# EAGLE design controller-v1 (EAGLE 7.5.0)
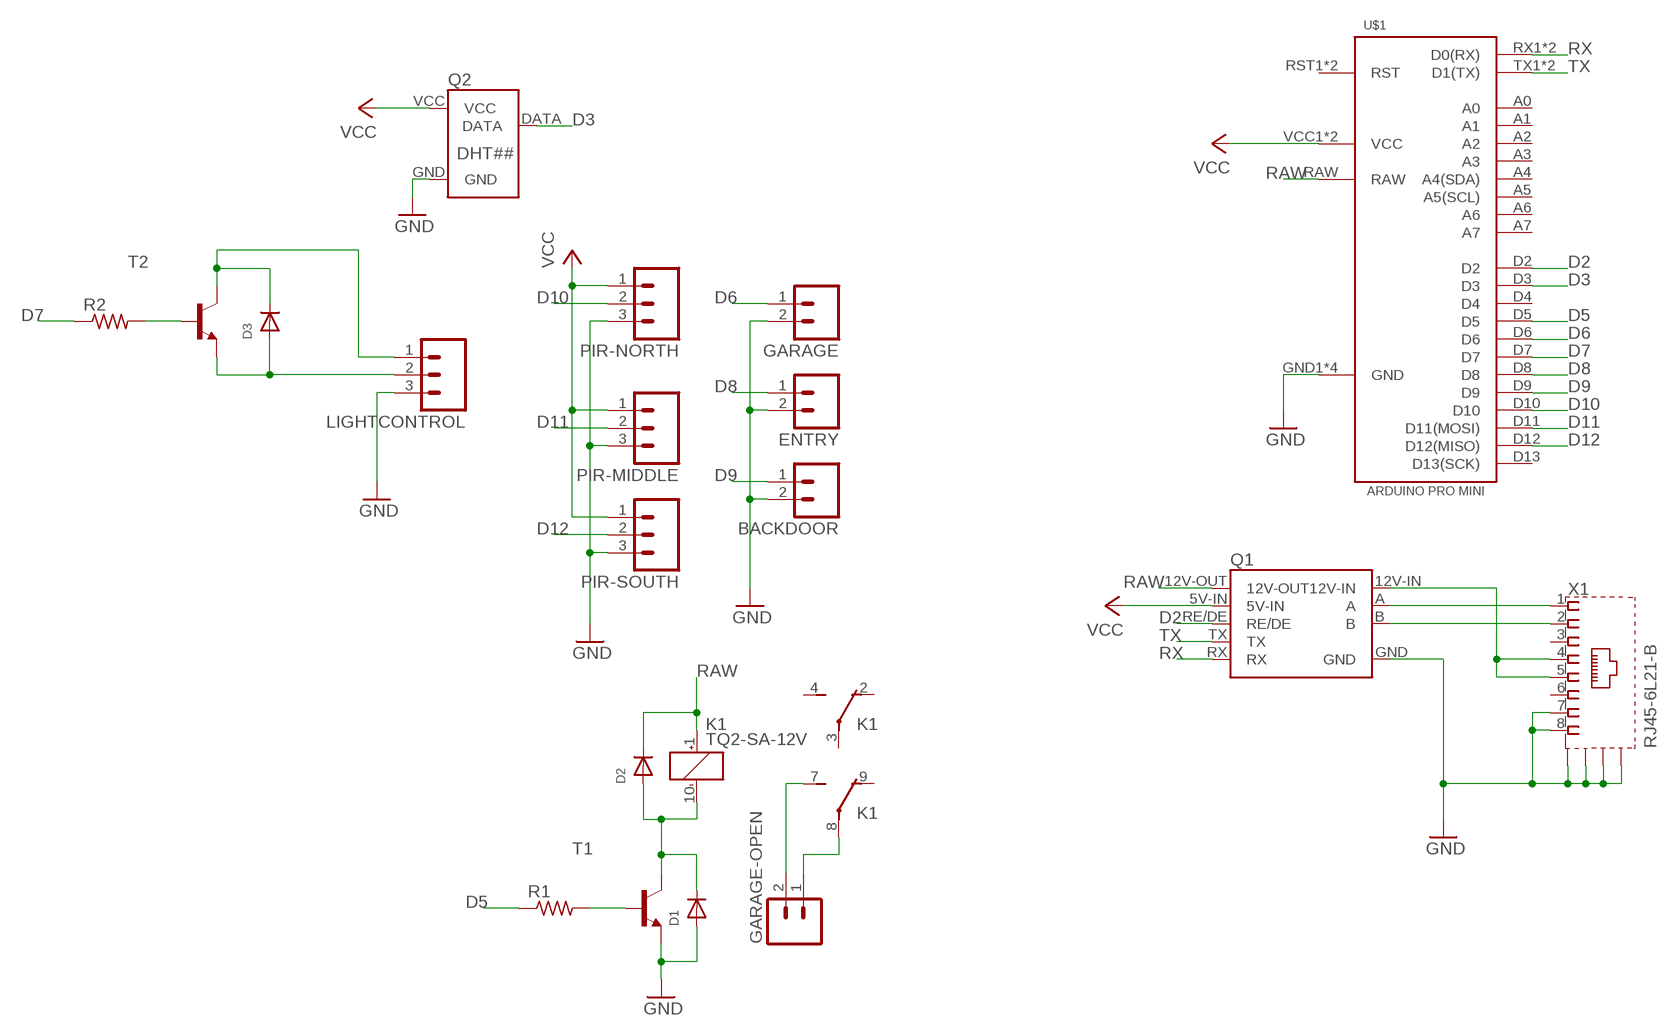
[diagram p0: schematic, sheet 1]

## Parts
BACKDOOR  M02  [02P]
D1  DIODESMA  [SMADIODE]
D2  DIODESMA  [SMADIODE]
D3  DIODESMA  [SMADIODE]
ENTRY  M02  [02P]
GARAGE  M02  [02P]
GARAGE-OPEN  M02  [02P]
K1  TQ2-SA-12V  [TQ-SA]
LIGHTCONTROL  M03  [03P]
PIR-MIDDLE  M03  [03P]
PIR-NORTH  M03  [03P]
PIR-SOUTH  M03  [03P]
Q1  RS485-ADAPTER0.05-CONNECTOR  [RS485-ADAPTOR-05]
Q2  DHT##  [CONNECTOR-4-PIN-0.1]
R1  R-US_R0603  [R0603]
R2  R-US_R0603  [R0603]
T1  BC808-NPN-SOT23-BEC  [SOT23-BEC]
T2  BC808-NPN-SOT23-BEC  [SOT23-BEC]
U$1  ARDUINO-PRO-MINI  [ARDUINO-PRO-MINI]
X1  RJ45-6L21-B  [RJ45-SHIELD1]

## Nets
D2: Q1.RE/DE U$1.D2
D3: Q2.DATA U$1.D3
D5: R1.1 U$1.D5
D6: GARAGE.1 U$1.D6
D7: R2.1 U$1.D7
D8: ENTRY.1 U$1.D8
D9: BACKDOOR.1 U$1.D9
D10: PIR-NORTH.2 U$1.D10
D11: PIR-MIDDLE.2 U$1.D11(D11(MOSI))
D12: PIR-SOUTH.2 U$1.D12(D12(MISO))
GND: BACKDOOR.2 D1.A ENTRY.2 GARAGE.2 LIGHTCONTROL.3 PIR-MIDDLE.3 PIR-NORTH.3 PIR-SOUTH.3 Q1.GND Q2.GND T1.E U$1.GND1(GND) U$1.GND2(GND) U$1.GND3(GND) U$1.GND4(GND) X1.7 X1.8 X1.S1(S) X1.S2(S) X1.S3(S) X1.S4(S)
N$1: D3.A LIGHTCONTROL.2 T2.E
N$8: Q1.12V-IN X1.4 X1.5
N$9: GARAGE-OPEN.1 K1.8(2:P)
N$10: Q1.A X1.1
N$11: Q1.B X1.2
N$12: GARAGE-OPEN.2 K1.7(2:S)
N$13: D1.C D2.A K1.10(_:-) T1.C
N$14: R1.2 T1.B
N$21: D3.C LIGHTCONTROL.1 T2.C
N$22: R2.2 T2.B
RAW: D2.C K1.1(_:+) Q1.12V-OUT U$1.RAW
RX: Q1.RX U$1.RX1(D0(RX)) U$1.RX2(D0(RX))
TX: Q1.TX U$1.TX1(D1(TX)) U$1.TX2(D1(TX))
VCC: PIR-MIDDLE.1 PIR-NORTH.1 PIR-SOUTH.1 Q1.5V-IN Q2.VCC U$1.VCC1(VCC) U$1.VCC2(VCC)
Unconnected: K1.2(1:O) K1.3(1:P) K1.4(1:S) K1.9(2:O) U$1.A0 U$1.A1 U$1.A2 U$1.A3 U$1.A4(A4(SDA)) U$1.A5(A5(SCL)) U$1.A6 U$1.A7 U$1.D4 U$1.D13(D13(SCK)) U$1.RST1(RST) U$1.RST2(RST) X1.3 X1.6

## Library data of the parts
BACKDOOR ENTRY GARAGE GARAGE-OPEN = con-amp-quick:M02: AMP QUICK CONNECTOR; OC_FARNELL: unknown; OC_NEWARK: unknown
D1-D3 = adafruit:DIODE: Diode SMADIODE - SMA Surface Mount Package 20V 1A Schottky Diode Digikey: 641-1014-6-ND DO-1N4148 - Through Hole Small Current Diode SOD-123 20V 1 A (.5mV Vf) Schottky Diode - Digikey: MBRX120TPMSCT-ND SOD-323 10V 570mA (.38mV Vf, 3ns) Schottky Diode - Digikey: ZLLS410CT-ND SOD-523 30V 30mA Schottky Diode (RB751S-40TE61) - Digikey: RB751S-40TE61CT-ND SOT23-R/W - SOT23 Package (R = Solder Paste/Reflow Ovens, W = Hand-Soldering) BAT54Film 40V 300mA - Digikey: 497-7162-1-ND
K1 = relay:TQ2?*: LOW PROFILE 2 FORM C RELAY NAiS Source: http://www.mew-europe.com/.. en_ds_61020_0001.pdf Source: http://www.mew-europe.com/.. en_ds_61020_0004.pdf; MF: AROMAT/ MATSUSHITA; MPN: TQ2SA-12V; OC_FARNELL: 1124056; OC_NEWARK: 64K3203
LIGHTCONTROL PIR-MIDDLE PIR-NORTH PIR-SOUTH = con-amp-quick:M03: AMP QUICK CONNECTOR; OC_FARNELL: unknown; OC_NEWARK: unknown
Q1 = serge:RS485-ADAPTER
Q2 = serge:DHT##
R1 R2 = adafruit:R-US_: RESISTOR, American symbol
T1 T2 = transistor:*-NPN-: NPN Transistror BF959 corrected 2008.03.06
U$1 = serge:ARDUINO-PRO-MINI
X1 = con-tycoelectronics:RJ45*2: RJ45 Low Profile Shield Type 2 For all RJ45 L, LC, LCT and X Series Models Source: www.tycoelectronics.com .. ENG_DS_1654001_1099_RJ_L_0507.pdf; OC_FARNELL: unknown; OC_NEWARK: unknown

## Board
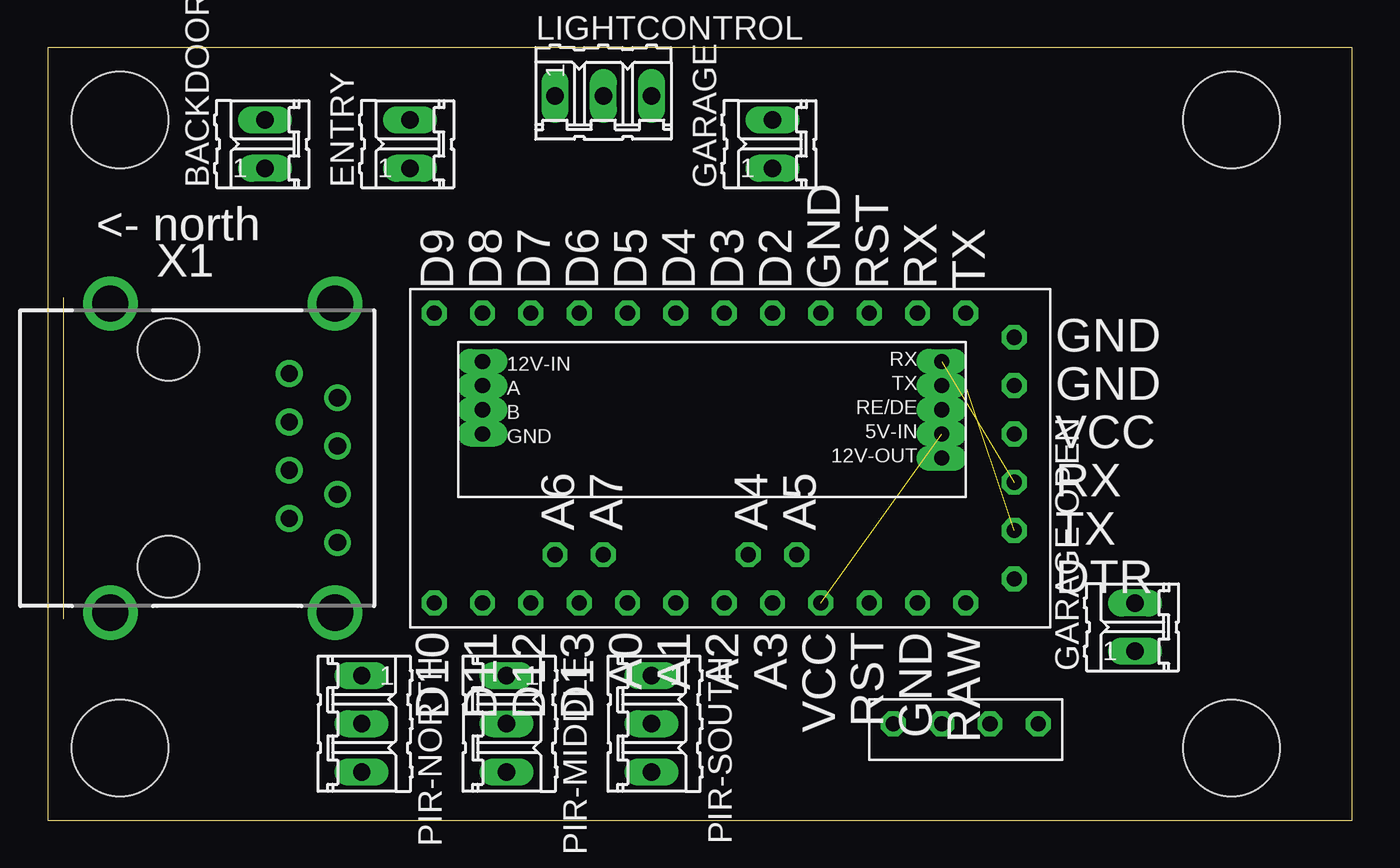
[diagram p1: board, top side]
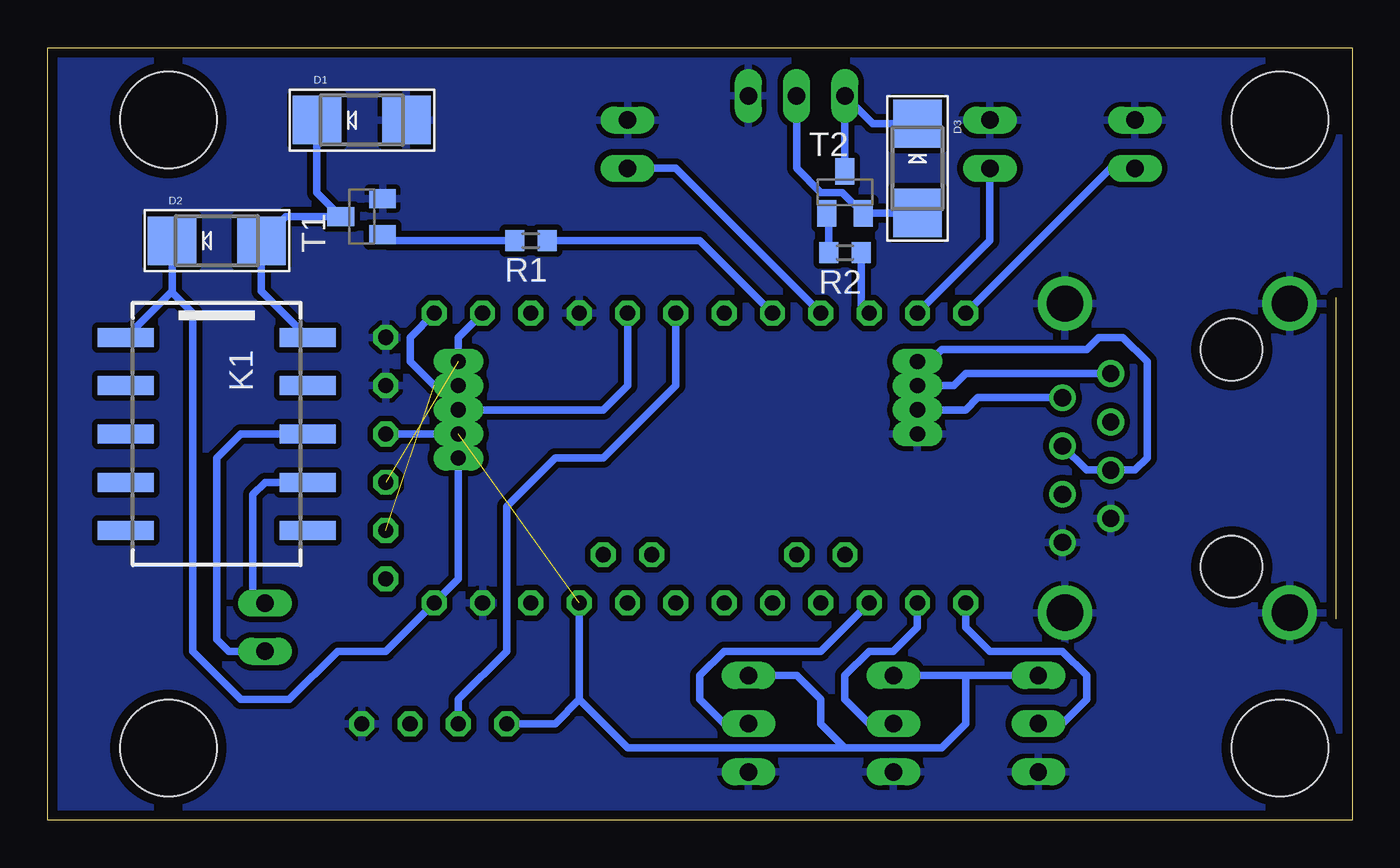
[diagram p2: board, bottom side, seen from below]

Size 68.58 x 40.64 mm. Coordinates in mm from the lower left corner, seen from the top.
Outline: 0,0 68.58,0 68.58,40.64 0,40.64 0,0
Copper layers (1*16): Top 0.035mm / dielectric 1.5mm / Bottom 0.035mm
Design rules "default *": minimum track width 10mil, minimum drill 24mil, track to track 12mil, track to pad 12mil, pad to pad 12mil, via to via 12mil, smd to smd 12mil, copper to edge 20mil, drill to drill 8mil, minimum pad ring 10mil, minimum via ring 8mil, stop-mask expansion 4mil, vias tented up to drill 0mil, thermal gap 10mil
Holes 5.08 mm at 3.81,3.81 3.81,36.83 62.23,36.83 62.23,3.81

### Footprints (pad centres in the part's own frame; a part is rotated, then mirrored left to right if it is on the bottom)
02P = drill 0.914 long: 1 -1.27,0; 2 1.27,0
SMADIODE = smd 2.54 x 2.54: A 2.349,0; C -2.349,0
TQ-SA = smd 1 x 2.94: 1 -5.08,-4.78; 2 -2.54,-4.78; 3 0,-4.78; 4 2.54,-4.78; 5 5.08,-4.78; 6 5.08,4.78; 7 2.54,4.78; 8 0,4.78; 9 -2.54,4.78; 10 -5.08,4.78
03P = drill 0.914 long: 1 -2.54,0; 2 0,0; 3 2.54,0
RS485-ADAPTOR-05 = drill 0.8 pad 1.016 long: 5V-IN -11.43,1.27; 12V-IN 12.7,-2.54; 12V-OUT -11.43,2.54; A 12.7,-1.27; B 12.7,0; GND 12.7,1.27; RE/DE -11.43,0; RX -11.43,-2.54; TX -11.43,-1.27
CONNECTOR-4-PIN-0.1 = drill 0.8 octagon: DATA -1.27,0; GND 3.81,0; N/C 1.27,0; VCC -3.81,0
R0603 = smd 1 x 1.1: 1 -0.85,0; 2 0.85,0
SOT23-BEC = smd 1 x 1.4: B -0.95,-1.1; C 0,1.1; E 0.95,-1.1
ARDUINO-PRO-MINI = drill 0.8 octagon: A0 -3.81,-7.62; A1 -1.27,-7.62; A2 1.27,-7.62; A3 3.81,-7.62; A4 2.54,-5.08; A5 5.08,-5.08; A6 -7.62,-5.08; A7 -5.08,-5.08; D2 3.81,7.62; D3 1.27,7.62; D4 -1.27,7.62; D5 -3.81,7.62; D6 -6.35,7.62; D7 -8.89,7.62; D8 -11.43,7.62; D9 -13.97,7.62; D10 -13.97,-7.62; D11 -11.43,-7.62; D12 -8.89,-7.62; D13 -6.35,-7.62; DTR 16.51,-6.35; GND1 11.43,-7.62; GND2 16.51,6.35; GND3 16.51,3.81; GND4 6.35,7.62; RAW 13.97,-7.62; RST1 8.89,7.62; RST2 8.89,-7.62; RX1 11.43,7.62; RX2 16.51,-1.27; TX1 13.97,7.62; TX2 16.51,-3.81; VCC1 16.51,1.27; VCC2 6.35,-7.62
RJ45-SHIELD1 = drill 0.9 pad 1.4: 1 -4.445,6.35; 2 -3.175,8.89; 3 -1.905,6.35; 4 -0.635,8.89; 5 0.635,6.35; 6 1.905,8.89; 7 3.175,6.35; 8 4.445,8.89 | drill 1.9 pad 2.5: S1 -8.128,-3.048; S2 8.128,-3.048; S3 -8.128,8.76; S4 8.128,8.76 | hole 3.251: -5.715,0; 5.715,0

### Placement (x,y rotation side)
BACKDOOR  11.43,35.56 90 top
D1  52.07,36.83 0 bottom
D2  59.69,30.48 0 bottom
D3  22.86,34.29 270 bottom
ENTRY  19.05,35.56 90 top
GARAGE  38.1,35.56 90 top
GARAGE-OPEN  57.15,10.16 90 top
K1  59.69,20.32 270 bottom
LIGHTCONTROL  29.21,38.1 0 top
PIR-MIDDLE  24.13,5.08 270 top
PIR-NORTH  16.51,5.08 270 top
PIR-SOUTH  31.75,5.08 270 top
Q1  35.56,21.59 180 top
Q2  48.26,5.08 0 top
R1  43.18,30.48 180 bottom
R2  26.67,29.84 180 bottom
T1  52.07,31.75 90 bottom
T2  26.67,33.02 0 bottom
U$1  34.29,19.05 0 top
X1  6.35,19.05 270 top

### Tracks (layer width: path | path; a pad name or v marks a point on that pad's centre or on a via)
D2
  Bottom 0.406: U$1.D2 38.1,22.86 39.37,21.59 Q1.RE/DE
D3
  Bottom 0.406: Q2.DATA 46.99,6.35 44.45,8.89 44.45,16.51 41.91,19.05 39.37,19.05 35.56,22.86 U$1.D3
D5
  Bottom 0.406: U$1.D5 34.29,30.48 R1.1
D6
  Bottom 0.406: GARAGE.1 35.56,34.29 U$1.D6
D7
  Bottom 0.406: R2.1 25.82,27.09 U$1.D7
D8
  Bottom 0.406: ENTRY.1 19.05,30.48 U$1.D8
D9
  Bottom 0.406: U$1.D9 12.7,34.29 BACKDOOR.1
D10
  Bottom 0.406: U$1.D10 20.32,10.16 19.05,8.89 15.24,8.89 13.97,7.62 13.97,6.35 15.24,5.08 PIR-NORTH.2
D11
  Bottom 0.406: U$1.D11 22.86,10.16 24.13,8.89 25.4,8.89 26.67,7.62 26.67,6.35 25.4,5.08 PIR-MIDDLE.2
D12
  Bottom 0.406: U$1.D12 27.94,8.89 33.02,8.89 34.29,7.62 34.29,6.35 33.02,5.08 PIR-SOUTH.2
GND
  pour Bottom: 0,40.64 68.58,40.64 68.58,0 0,0
N$1
  Bottom 0.406: D3.A 22.88,31.92 T2.E 26.82,33.02 27.94,33.02 29.21,34.29 LIGHTCONTROL.2
N$8
  Bottom 0.406: Q1.12V-IN 22.23,24.13 21.59,24.77 13.97,24.77 13.34,25.4 12.06,25.4 10.79,24.13 10.79,19.05 11.43,18.41 X1.5 13.97,18.41 X1.4
N$9
  Bottom 0.406: GARAGE-OPEN.1 59.05,8.89 59.69,9.53 59.69,19.05 58.42,20.32 K1.8
N$10
  Bottom 0.406: X1.1 20.32,23.5 20.95,22.86 Q1.A
N$11
  Bottom 0.406: X1.2 19.68,22.23 20.32,21.59 Q1.B
N$12
  Bottom 0.406: GARAGE-OPEN.2 57.78,12.06 57.78,17.14 57.15,17.78 K1.7
N$13
  Bottom 0.406: K1.10 57.34,27.83 D2.A 56.07,31.75 T1.C 54.42,33 D1.C
N$14
  Bottom 0.406: R1.2 50.65,30.48 T1.B
N$21
  Bottom 0.406: T2.C LIGHTCONTROL.1 25.21,36.64 D3.C
N$22
  Bottom 0.406: R2.2 27.52,31.82 T2.B
RAW
  Bottom 0.406: Q1.12V-OUT 46.99,12.7 U$1.RAW 50.8,8.89 53.34,8.89 55.88,6.35 58.42,6.35 60.96,8.89 60.96,26.67 62.04,27.75 62.04,27.83 | D2.C 62.04,27.83 | 62.04,27.83 K1.1
RX  (1 unrouted)
  Bottom 0.406: Q1.RX 46.99,25.4 U$1.RX1
TX  (1 unrouted)
  Bottom 0.406: Q1.TX 48.26,22.86 49.53,24.13 49.53,25.4 U$1.TX1
VCC  (1 unrouted)
  Bottom 0.406: PIR-NORTH.1 20.32,7.62 | 20.32,7.62 PIR-MIDDLE.1 | PIR-SOUTH.1 29.21,7.62 27.94,6.35 27.94,5.08 26.67,3.81 | 26.67,3.81 21.59,3.81 20.32,5.08 20.32,7.62 | Q1.5V-IN U$1.VCC1 | U$1.VCC2 40.64,6.35 | 40.64,6.35 38.1,3.81 26.67,3.81 | Q2.VCC 41.91,5.08 40.64,6.35

### Text on the board
tNames: <- north